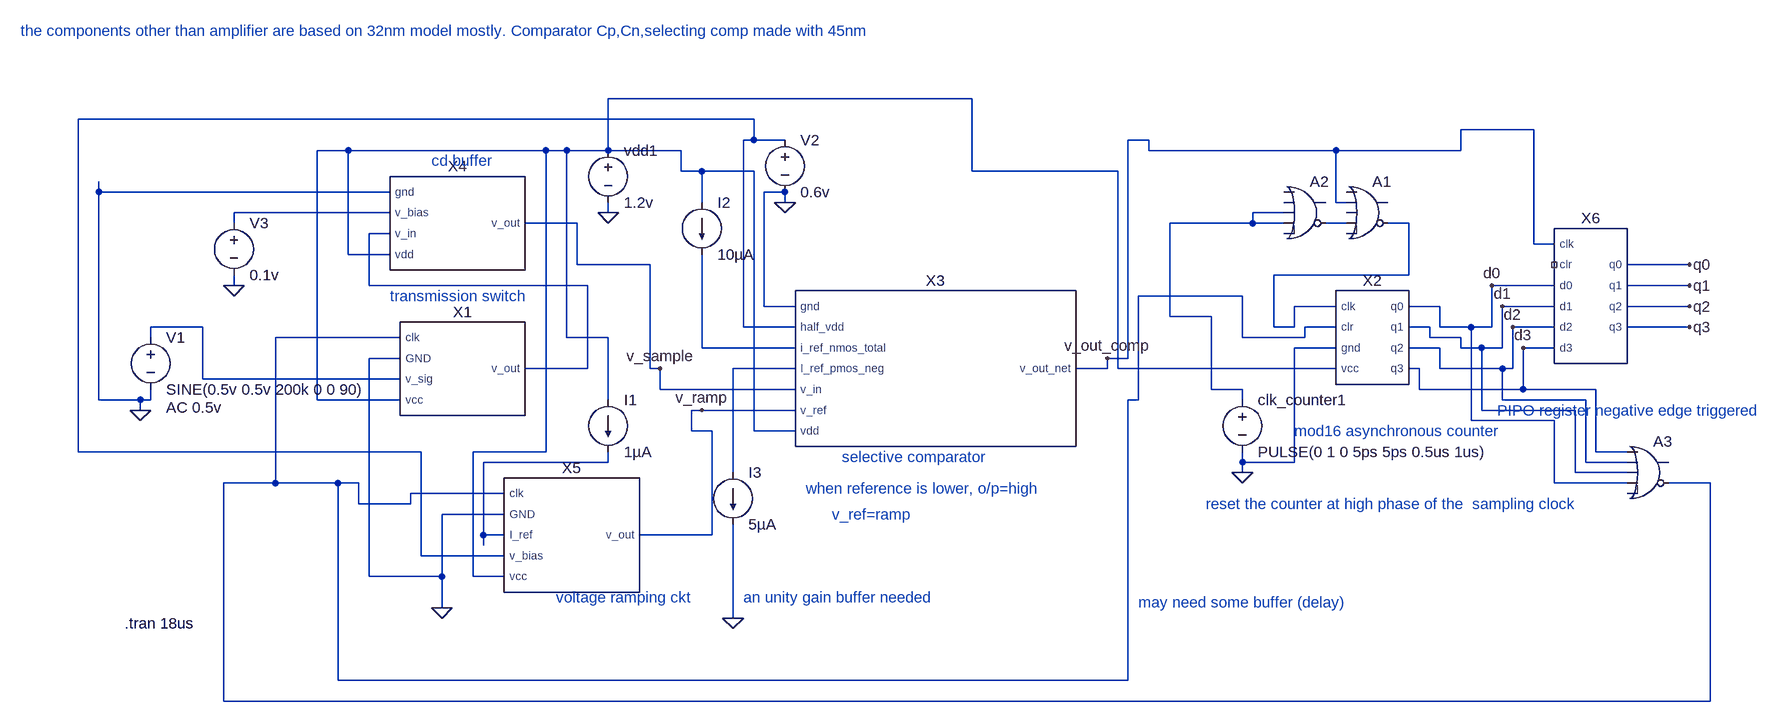
[diagram p0: schematic ADC_allblocks_oneClock.asc]
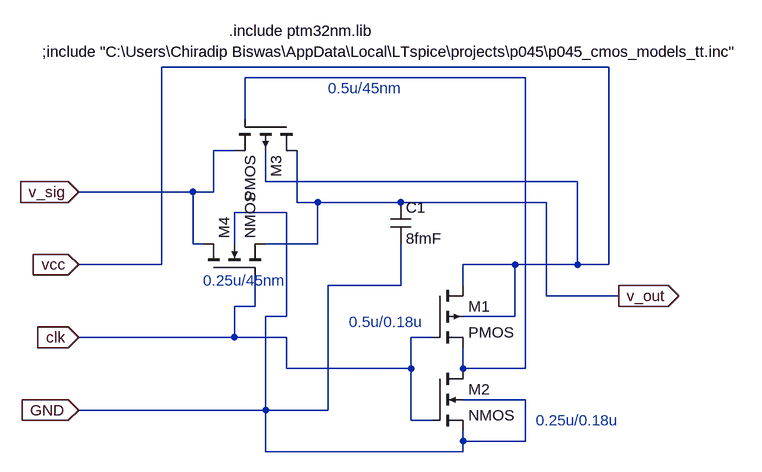
[diagram p1: sub-circuit transmission_switch_100ns_5ns_5ps_8fmf_symbolckt.asc]
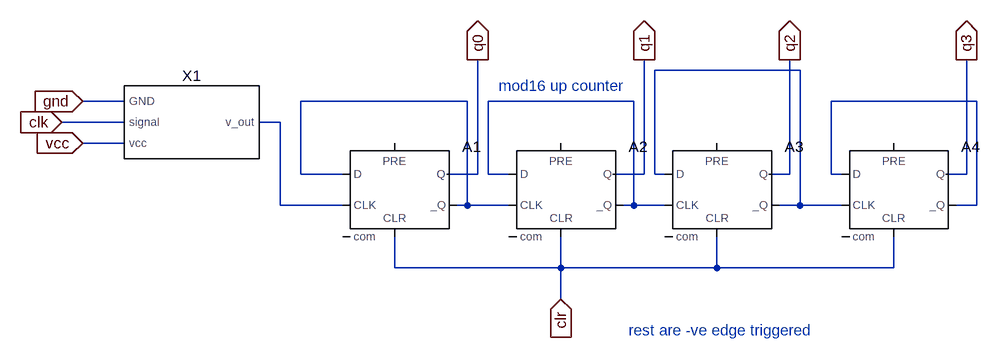
[diagram p2: sub-circuit mod16upcounter_ckt.asc]
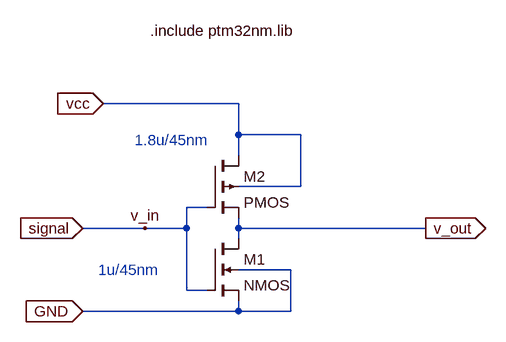
[diagram p3: sub-circuit fast_inverterckt.asc]
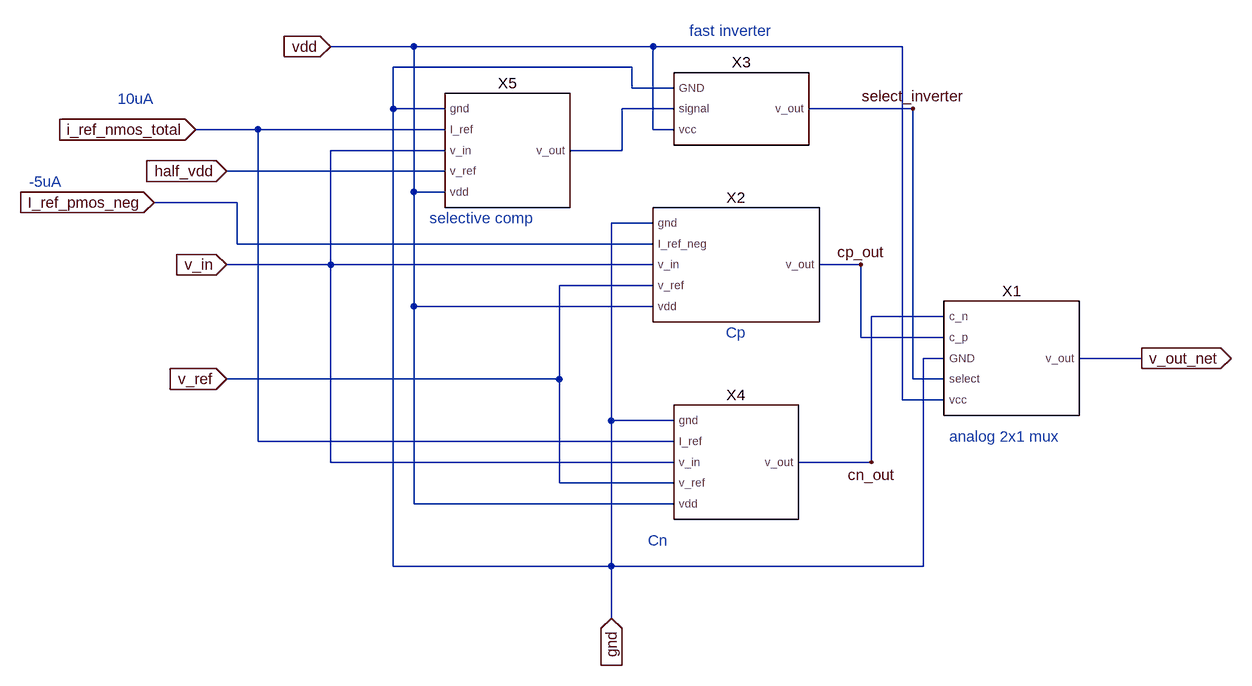
[diagram p4: sub-circuit cp_cn_selective_comp_new_ckt.asc]
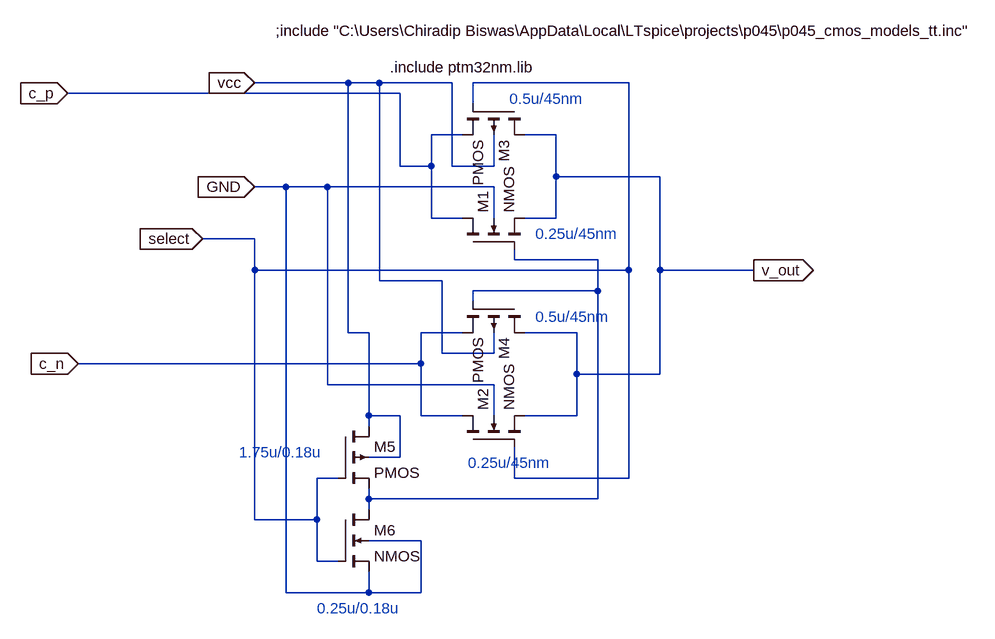
[diagram p5: sub-circuit analog_2_to_1mux.asc]
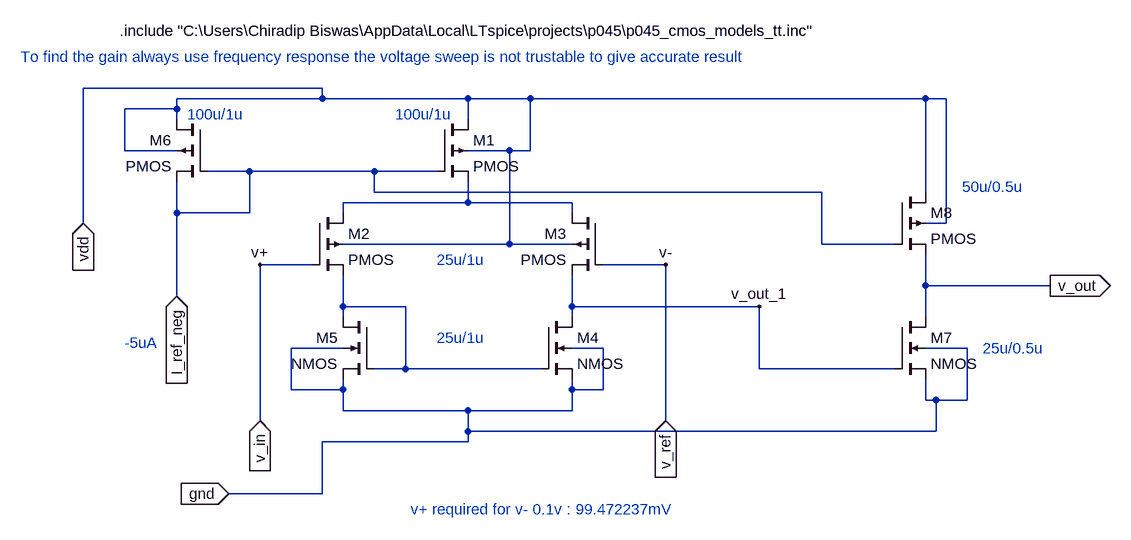
[diagram p6: sub-circuit static_comparator_pmosbased_ckt.asc]
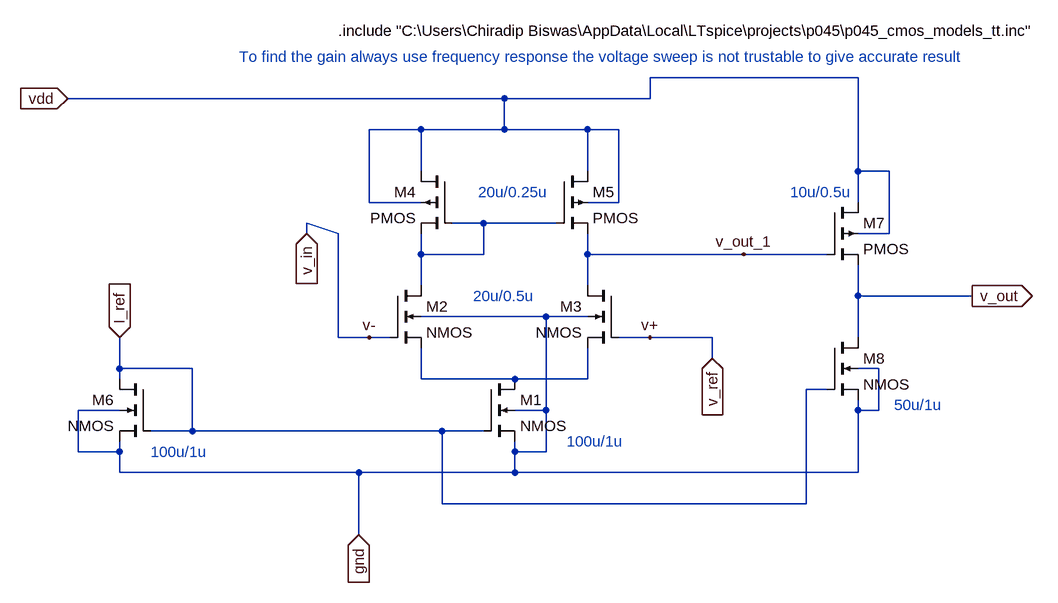
[diagram p7: sub-circuit static_comparator_nmos_based_ckt.asc]
ADC_allblocks_oneClock.asc, the LTspice schematic file:
Version 4
SHEET 1 2212 836
WIRE 960 -96 400 -96
WIRE 624 -64 -416 -64
WIRE 1824 -48 1712 -48
WIRE 624 -32 624 -64
WIRE 624 -32 608 -32
WIRE 672 -32 624 -32
WIRE 1232 -32 1200 -32
WIRE 0 -16 -48 -16
WIRE 304 -16 0 -16
WIRE 336 -16 304 -16
WIRE 400 -16 400 -96
WIRE 400 -16 336 -16
WIRE 512 -16 400 -16
WIRE 1232 -16 1232 -32
WIRE 1520 -16 1232 -16
WIRE 1712 -16 1712 -48
WIRE 1712 -16 1520 -16
WIRE 512 16 512 -16
WIRE 544 16 512 16
WIRE 624 16 544 16
WIRE 960 16 960 -96
WIRE 1184 16 960 16
WIRE -384 48 -384 32
WIRE 64 48 -384 48
WIRE 672 48 640 48
WIRE 544 64 544 16
WIRE 672 64 672 48
WIRE 1520 64 1520 -16
WIRE 1536 64 1520 64
WIRE 64 80 -176 80
WIRE 400 80 400 64
WIRE 1440 80 1392 80
WIRE -176 96 -176 80
WIRE 352 96 272 96
WIRE 1392 96 1392 80
WIRE 1392 96 1264 96
WIRE 1440 96 1392 96
WIRE 1536 96 1504 96
WIRE 1632 96 1600 96
WIRE 64 112 32 112
WIRE 1824 128 1824 -48
WIRE 1856 128 1824 128
WIRE 0 144 0 -16
WIRE 64 144 0 144
WIRE 352 160 352 96
WIRE 464 160 352 160
WIRE 2064 160 1968 160
WIRE 1632 176 1632 96
WIRE 1632 176 1424 176
WIRE -176 192 -176 176
WIRE 32 192 32 112
WIRE 368 192 32 192
WIRE 1856 192 1760 192
WIRE 2064 192 1968 192
WIRE 1376 208 1216 208
WIRE 640 224 640 48
WIRE 688 224 640 224
WIRE 1520 224 1456 224
WIRE 1680 224 1632 224
WIRE 1856 224 1776 224
WIRE 2064 224 1968 224
WIRE 1264 240 1264 96
WIRE 1328 240 1264 240
WIRE -224 256 -304 256
WIRE 608 256 608 -32
WIRE 688 256 608 256
WIRE 1424 256 1424 176
WIRE 1456 256 1456 224
WIRE 1456 256 1424 256
WIRE 1520 256 1472 256
WIRE 1664 256 1632 256
WIRE 1680 256 1680 224
WIRE 1728 256 1680 256
WIRE 1760 256 1760 192
WIRE 1760 256 1728 256
WIRE 1856 256 1792 256
WIRE 2064 256 1968 256
WIRE -304 272 -304 256
WIRE 80 272 -112 272
WIRE 336 272 336 -16
WIRE 400 272 336 272
WIRE 1376 272 1376 208
WIRE 1472 272 1472 256
WIRE 1472 272 1376 272
WIRE 1664 272 1664 256
WIRE 1712 272 1664 272
WIRE 544 288 544 144
WIRE 688 288 544 288
WIRE 1520 288 1456 288
WIRE 1680 288 1632 288
WIRE 1712 288 1712 272
WIRE 1744 288 1712 288
WIRE 1776 288 1776 224
WIRE 1776 288 1744 288
WIRE 1856 288 1808 288
WIRE 80 304 32 304
WIRE 1200 304 1200 -32
WIRE 1200 304 1168 304
WIRE 368 320 368 192
WIRE 368 320 272 320
WIRE 464 320 464 160
WIRE 480 320 464 320
WIRE 688 320 592 320
WIRE 1168 320 1168 304
WIRE 1168 320 1120 320
WIRE 1184 320 1184 16
WIRE 1520 320 1184 320
WIRE 1648 320 1632 320
WIRE 1680 320 1680 288
WIRE 1776 320 1680 320
WIRE 1792 320 1792 256
WIRE 1792 320 1776 320
WIRE -224 336 -224 256
WIRE 80 336 -224 336
WIRE 480 352 480 320
WIRE 688 352 480 352
WIRE 1328 352 1328 240
WIRE 1376 352 1328 352
WIRE 1648 352 1648 320
WIRE 1808 352 1808 288
WIRE 1808 352 1648 352
WIRE 1920 352 1808 352
WIRE -384 368 -384 48
WIRE -320 368 -384 368
WIRE -304 368 -304 352
WIRE -304 368 -320 368
WIRE -48 368 -48 -16
WIRE 80 368 -48 368
WIRE 400 368 400 272
WIRE 1216 368 1216 208
WIRE 1216 368 1200 368
WIRE 1376 368 1376 352
WIRE 1776 368 1776 320
WIRE 1904 368 1776 368
WIRE -320 384 -320 368
WIRE 544 384 528 384
WIRE 688 384 544 384
WIRE 1744 384 1744 288
WIRE 1888 384 1744 384
WIRE 1728 400 1728 256
WIRE 1856 400 1728 400
WIRE 528 416 528 384
WIRE 560 416 528 416
WIRE 624 416 624 16
WIRE 688 416 624 416
WIRE -416 448 -416 -64
WIRE 112 448 -416 448
WIRE 304 448 304 -16
WIRE 304 448 192 448
WIRE 1920 448 1920 352
WIRE 1968 448 1920 448
WIRE 400 464 400 448
WIRE 400 464 208 464
WIRE 1376 464 1376 448
WIRE 1456 464 1456 288
WIRE 1456 464 1376 464
WIRE 1904 464 1904 368
WIRE 1968 464 1904 464
WIRE 592 480 592 320
WIRE 1376 480 1376 464
WIRE 1888 480 1888 384
WIRE 1968 480 1888 480
WIRE -112 496 -112 272
WIRE -112 496 -192 496
WIRE -16 496 -112 496
WIRE 16 496 -16 496
WIRE 1856 496 1856 400
WIRE 1968 496 1856 496
WIRE 2096 496 2032 496
WIRE 240 512 96 512
WIRE 16 528 16 496
WIRE 96 528 96 512
WIRE 96 528 16 528
WIRE 240 544 144 544
WIRE 208 576 208 464
WIRE 240 576 208 576
WIRE 560 576 560 416
WIRE 560 576 448 576
WIRE 208 592 208 576
WIRE 112 608 112 448
WIRE 240 608 112 608
WIRE 32 640 32 304
WIRE 144 640 144 544
WIRE 144 640 32 640
WIRE 192 640 192 448
WIRE 240 640 192 640
WIRE 144 688 144 640
WIRE 592 704 592 560
WIRE -16 800 -16 496
WIRE 1200 800 1200 368
WIRE 1200 800 -16 800
WIRE -192 832 -192 496
WIRE 2096 832 2096 496
WIRE 2096 832 -192 832
FLAG -320 384 0
FLAG 400 80 0
FLAG 144 688 0
FLAG 1168 304 v_out_comp
FLAG 672 64 0
FLAG 1376 480 0
FLAG 1760 192 d0
FLAG 1776 224 d1
FLAG 1792 256 d2
FLAG 1808 288 d3
FLAG 2064 192 q1
FLAG 2064 224 q2
FLAG 2064 256 q3
FLAG 544 384 v_ramp
FLAG 480 320 v_sample
FLAG 592 704 0
FLAG -176 192 0
FLAG 2064 160 q0
SYMBOL transmission_switch_100ns_5ns_5ps_8fmF_symbolCKT 176 320 R0
SYMATTR InstName X1
SYMBOL voltage -304 256 R0
WINDOW 123 24 124 Left 2
WINDOW 39 0 0 Left 0
SYMATTR Value2 AC 0.5v
SYMATTR InstName V1
SYMATTR Value SINE(0.5v 0.5v 200k 0 0 90)
SYMBOL voltage 400 -32 R0
WINDOW 123 0 0 Left 0
WINDOW 39 0 0 Left 0
SYMATTR InstName vdd1
SYMATTR Value 1.2v
SYMBOL current 400 368 R0
WINDOW 123 0 0 Left 0
WINDOW 39 0 0 Left 0
SYMATTR InstName I1
SYMATTR Value 1µA
SYMBOL voltage 672 -48 R0
WINDOW 123 0 0 Left 0
WINDOW 39 0 0 Left 0
SYMATTR InstName V2
SYMATTR Value 0.6v
SYMBOL voltage 1376 352 R0
WINDOW 123 0 0 Left 0
WINDOW 39 0 0 Left 0
SYMATTR InstName clk_counter1
SYMATTR Value PULSE(0 1 0 5ps 5ps 0.5us 1us)
SYMBOL mod16UpCounter_ckt 1568 272 R0
SYMATTR InstName X2
SYMBOL cp_cn_selective_comp_new_ckt 896 320 R0
SYMATTR InstName X3
SYMBOL current 544 64 R0
WINDOW 123 0 0 Left 0
WINDOW 39 0 0 Left 0
SYMATTR InstName I2
SYMATTR Value 10µA
SYMBOL current 592 480 R0
WINDOW 123 0 0 Left 0
WINDOW 39 0 0 Left 0
SYMATTR InstName I3
SYMATTR Value 5µA
SYMBOL Digital\\or 1568 16 R0
SYMATTR InstName A1
SYMBOL Digital\\or 1472 16 R0
SYMATTR InstName A2
SYMBOL cd_buffer_const_pot 160 96 R0
SYMATTR InstName X4
SYMBOL voltage -176 80 R0
WINDOW 123 0 0 Left 0
WINDOW 39 0 0 Left 0
SYMATTR InstName V3
SYMATTR Value 0.1v
SYMBOL ramp_ckt_32nm_cd_buffer_ckt 336 576 R0
SYMATTR InstName X5
SYMBOL 1st_stage_pos_edge_4bit_pipo 1904 208 R0
SYMATTR InstName X6
SYMBOL Digital\\or 2000 416 R0
SYMATTR InstName A3
TEXT -344 712 Left 2 !.tran 18us
TEXT 64 208 Left 2 ;transmission switch
TEXT 320 672 Left 2 ;voltage ramping ckt
TEXT 760 456 Left 2 ;selective comparator
TEXT 704 504 Left 2 ;when reference is lower, o/p=high
TEXT 1768 384 Left 2 ;PIPO register negative edge triggered
TEXT 1456 416 Left 2 ;mod16 asynchronous counter
TEXT 1320 528 Left 2 ;reset the counter at high phase of the  sampling clock
TEXT 1216 680 Left 2 ;may need some buffer (delay)
TEXT 608 672 Left 2 ;an unity gain buffer needed
TEXT 744 544 Left 2 ;v_ref=ramp
TEXT -504 -200 Left 2 ;the components other than amplifier are based on 32nm model mostly. Comparator Cp,Cn,selecting comp made with 45nm
TEXT 128 0 Left 2 ;cd buffer

transmission_switch_100ns_5ns_5ps_8fmf_symbolckt.asc, the sub-circuit schematic file:
Version 4
SHEET 1 1200 680
WIRE 864 -144 176 -144
WIRE 736 -128 304 -128
WIRE 304 -64 304 -128
WIRE 288 -16 256 -16
WIRE 336 32 336 -16
WIRE 816 32 336 32
WIRE 224 48 48 48
WIRE 256 48 256 -16
WIRE 256 48 224 48
WIRE 384 64 384 -16
WIRE 416 64 384 64
WIRE 544 64 416 64
WIRE 768 64 544 64
WIRE 368 80 288 80
WIRE 224 128 224 48
WIRE 240 128 224 128
WIRE 288 128 288 80
WIRE 416 128 416 64
WIRE 416 128 336 128
WIRE 176 160 176 -144
WIRE 176 160 48 160
WIRE 720 160 640 160
WIRE 816 160 816 32
WIRE 816 160 720 160
WIRE 864 160 864 -144
WIRE 864 160 816 160
WIRE 544 192 544 128
WIRE 544 192 432 192
WIRE 640 192 640 160
WIRE 768 208 768 64
WIRE 880 208 768 208
WIRE 320 224 320 176
WIRE 320 224 288 224
WIRE 368 240 368 80
WIRE 368 240 336 240
WIRE 720 240 720 160
WIRE 720 240 640 240
WIRE 288 272 288 224
WIRE 288 272 48 272
WIRE 368 272 288 272
WIRE 592 272 560 272
WIRE 368 320 368 272
WIRE 560 320 560 272
WIRE 560 320 368 320
WIRE 640 320 640 288
WIRE 736 320 736 -128
WIRE 736 320 640 320
WIRE 736 368 640 368
WIRE 336 384 336 240
WIRE 336 384 48 384
WIRE 432 384 432 192
WIRE 432 384 336 384
WIRE 560 400 560 320
WIRE 592 400 560 400
WIRE 640 432 640 416
WIRE 736 432 736 368
WIRE 736 432 640 432
WIRE 336 448 336 384
WIRE 640 448 640 432
WIRE 640 448 336 448
FLAG 48 48 v_sig
IOPIN 48 48 In
FLAG 48 272 clk
IOPIN 48 272 In
FLAG 48 160 vcc
IOPIN 48 160 In
FLAG 880 208 v_out
IOPIN 880 208 Out
FLAG 48 384 GND
IOPIN 48 384 In
SYMBOL pmos4 592 192 R0
SYMATTR InstName M1
SYMATTR Value2 l=45nm w=30u
SYMBOL nmos4 592 320 R0
SYMATTR InstName M2
SYMATTR Value2 l=45nm w=15u
SYMBOL pmos4 384 -64 R90
SYMATTR InstName M3
SYMATTR Value2 l=45nm w=0.5u
SYMBOL nmos4 240 176 R270
SYMATTR InstName M4
SYMATTR Value2 l=45nm w=0.25u
SYMBOL cap 528 64 R0
SYMATTR InstName C1
SYMATTR Value 8fmF
TEXT 280 -200 Left 2 !.include ptm32nm.lib
TEXT 240 184 Left 2 ;0.25u/45nm
TEXT 752 400 Left 2 ;0.25u/0.18u
TEXT 464 248 Left 2 ;0.5u/0.18u
TEXT 432 -112 Left 2 ;0.5u/45nm
TEXT -8 -168 Left 2 !;include "C:\\Users\\Chiradip Biswas\\AppData\\Local\\LTspice\\projects\\p045\\p045_cmos_models_tt.inc"

mod16upcounter_ckt.asc, the sub-circuit schematic file:
Version 4
SHEET 1 1048 680
WIRE 720 -48 496 -48
WIRE -320 0 -384 0
WIRE 208 0 -48 0
WIRE 464 0 240 0
WIRE 992 0 768 0
WIRE -320 32 -416 32
WIRE -80 32 -112 32
WIRE -320 64 -384 64
WIRE -48 112 -48 0
WIRE 16 112 -48 112
WIRE 224 112 224 -64
WIRE 224 112 176 112
WIRE 240 112 240 0
WIRE 272 112 240 112
WIRE 480 112 480 -64
WIRE 480 112 432 112
WIRE 496 112 496 -48
WIRE 512 112 496 112
WIRE 704 112 704 -64
WIRE 704 112 672 112
WIRE 768 112 768 0
WIRE 784 112 768 112
WIRE 976 112 976 -64
WIRE 976 112 944 112
WIRE -80 160 -80 32
WIRE 16 160 -80 160
WIRE 208 160 208 0
WIRE 208 160 192 160
WIRE 272 160 208 160
WIRE 464 160 464 0
WIRE 464 160 448 160
WIRE 512 160 464 160
WIRE 720 160 720 -48
WIRE 720 160 688 160
WIRE 784 160 720 160
WIRE 992 160 992 0
WIRE 992 160 960 160
WIRE 96 256 96 208
WIRE 352 256 352 208
WIRE 352 256 96 256
WIRE 592 256 592 208
WIRE 592 256 352 256
WIRE 864 256 864 208
WIRE 864 256 592 256
WIRE 352 304 352 256
FLAG 224 -64 q0
IOPIN 224 -64 Out
FLAG 480 -64 q1
IOPIN 480 -64 Out
FLAG 704 -64 q2
IOPIN 704 -64 Out
FLAG 352 304 clr
IOPIN 352 304 In
FLAG -416 32 clk
IOPIN -416 32 In
FLAG 976 -64 q3
IOPIN 976 -64 Out
FLAG -384 64 vcc
IOPIN -384 64 In
FLAG -384 0 gnd
IOPIN -384 0 In
SYMBOL Digital\\dflop 96 64 R0
SYMATTR InstName A1
SYMBOL Digital\\dflop 352 64 R0
SYMATTR InstName A2
SYMBOL Digital\\dflop 592 64 R0
SYMATTR InstName A3
SYMBOL Digital\\dflop 864 64 R0
SYMATTR InstName A4
SYMBOL fast_inverterCKT -224 32 R0
SYMATTR InstName X1
TEXT 456 352 Left 2 ;rest are -ve edge triggered
TEXT 256 -24 Left 2 ;mod16 up counter

fast_inverterckt.asc, the sub-circuit schematic file:
Version 4
SHEET 1 1464 680
WIRE 352 32 144 32
WIRE 352 80 352 32
WIRE 448 80 352 80
WIRE 352 112 352 80
WIRE 448 160 448 80
WIRE 448 160 352 160
WIRE 304 192 272 192
WIRE 208 224 112 224
WIRE 272 224 272 192
WIRE 272 224 208 224
WIRE 352 224 352 208
WIRE 640 224 352 224
WIRE 352 240 352 224
WIRE 432 288 352 288
WIRE 272 320 272 224
WIRE 304 320 272 320
WIRE 352 352 352 336
WIRE 352 352 112 352
WIRE 432 352 432 288
WIRE 432 352 352 352
FLAG 208 224 v_in
FLAG 144 32 vcc
IOPIN 144 32 In
FLAG 112 224 signal
IOPIN 112 224 In
FLAG 112 352 GND
IOPIN 112 352 In
FLAG 640 224 v_out
IOPIN 640 224 Out
SYMBOL nmos4 304 240 R0
SYMATTR InstName M1
SYMATTR Value2 l=45nm w=1u
SYMBOL pmos4 304 112 R0
SYMATTR InstName M2
SYMATTR Value2 l=45nm w=1.8u
TEXT 192 88 Left 2 ;1.8u/45nm
TEXT 136 288 Left 2 ;1u/45nm
TEXT 216 -80 Left 2 !.include ptm32nm.lib

cp_cn_selective_comp_new_ckt.asc, the sub-circuit schematic file:
Version 4
SHEET 1 2192 824
WIRE 896 -160 768 -160
WIRE 1264 -160 896 -160
WIRE 1648 -160 1264 -160
WIRE 1232 -128 864 -128
WIRE 1232 -96 1232 -128
WIRE 1296 -96 1232 -96
WIRE 864 -64 864 -128
WIRE 944 -64 864 -64
WIRE 1296 -64 1216 -64
WIRE 1664 -64 1504 -64
WIRE 656 -32 560 -32
WIRE 944 -32 656 -32
WIRE 1264 -32 1264 -160
WIRE 1296 -32 1264 -32
WIRE 944 0 768 0
WIRE 1216 0 1216 -64
WIRE 1216 0 1136 0
WIRE 944 32 608 32
WIRE 896 64 896 -160
WIRE 944 64 896 64
WIRE 624 80 496 80
WIRE 1264 112 1200 112
WIRE 624 144 624 80
WIRE 1264 144 624 144
WIRE 768 176 768 0
WIRE 768 176 608 176
WIRE 1264 176 768 176
WIRE 1584 176 1520 176
WIRE 1264 208 1120 208
WIRE 896 240 896 64
WIRE 1264 240 896 240
WIRE 1712 256 1600 256
WIRE 1584 288 1584 176
WIRE 1712 288 1584 288
WIRE 1712 320 1680 320
WIRE 2016 320 1920 320
WIRE 1120 352 1120 208
WIRE 1120 352 608 352
WIRE 1664 352 1664 -64
WIRE 1712 352 1664 352
WIRE 1648 384 1648 -160
WIRE 1712 384 1648 384
WIRE 1200 416 1200 112
WIRE 1296 416 1200 416
WIRE 656 448 656 -32
WIRE 1296 448 656 448
WIRE 768 480 768 176
WIRE 1296 480 768 480
WIRE 1600 480 1600 256
WIRE 1600 480 1488 480
WIRE 1120 512 1120 352
WIRE 1296 512 1120 512
WIRE 896 544 896 240
WIRE 1296 544 896 544
WIRE 864 640 864 -64
WIRE 1200 640 1200 416
WIRE 1200 640 864 640
WIRE 1680 640 1680 320
WIRE 1680 640 1200 640
WIRE 1200 720 1200 640
FLAG 768 -160 vdd
IOPIN 768 -160 In
FLAG 2016 320 v_out_net
IOPIN 2016 320 Out
FLAG 1200 720 gnd
IOPIN 1200 720 In
FLAG 560 -32 i_ref_nmos_total
IOPIN 560 -32 In
FLAG 608 32 half_vdd
IOPIN 608 32 In
FLAG 608 176 v_in
IOPIN 608 176 In
FLAG 608 352 v_ref
IOPIN 608 352 In
FLAG 496 80 I_ref_pmos_neg
IOPIN 496 80 In
FLAG 1584 176 cp_out
FLAG 1600 480 cn_out
FLAG 1664 -64 select_inverter
SYMBOL analog_2_to_1mux 1808 320 R0
SYMATTR InstName X1
SYMBOL static_comparator_pmosbased_ckt 1392 176 R0
SYMATTR InstName X2
SYMBOL fast_inverterCKT 1392 -64 R0
SYMATTR InstName X3
SYMBOL static_comparator_nmos_based_ckt 1392 480 R0
SYMATTR InstName X4
SYMBOL static_comparator_nmos_based_ckt 1040 0 R0
SYMATTR InstName X5
TEXT 1376 280 Left 2 ;Cp
TEXT 920 104 Left 2 ;selective comp
TEXT 1720 440 Left 2 ;analog 2x1 mux
TEXT 1256 600 Left 2 ;Cn
TEXT 1320 -184 Left 2 ;fast inverter
TEXT 440 -80 Left 2 ;10uA
TEXT 304 48 Left 2 ;-5uA

analog_2_to_1mux.asc, the sub-circuit schematic file:
Version 4
SHEET 1 1128 872
WIRE 32 48 -112 48
WIRE 80 48 32 48
WIRE 192 48 80 48
WIRE 464 48 224 48
WIRE 112 64 -400 64
WIRE 224 80 224 48
WIRE 208 128 160 128
WIRE 352 128 304 128
WIRE 112 176 112 64
WIRE 160 176 160 128
WIRE 160 176 112 176
WIRE 192 176 192 48
WIRE 256 176 256 128
WIRE 256 176 192 176
WIRE 352 192 352 128
WIRE 512 192 352 192
WIRE -64 208 -112 208
WIRE 0 208 -64 208
WIRE 256 208 0 208
WIRE 160 256 160 176
WIRE 208 256 160 256
WIRE 256 256 256 208
WIRE 352 256 352 192
WIRE 352 256 304 256
WIRE -112 288 -192 288
WIRE 288 320 288 304
WIRE 416 320 288 320
WIRE -112 336 -112 288
WIRE 464 336 464 48
WIRE 464 336 -112 336
WIRE 512 336 512 192
WIRE 656 336 512 336
WIRE 80 352 80 48
WIRE 176 352 80 352
WIRE 416 368 416 320
WIRE 416 368 224 368
WIRE 224 384 224 368
WIRE 32 432 32 48
WIRE 64 432 32 432
WIRE 208 432 144 432
WIRE 384 432 304 432
WIRE 176 464 176 352
WIRE 256 464 256 432
WIRE 256 464 176 464
WIRE 144 480 144 432
WIRE 144 480 -384 480
WIRE 384 496 384 432
WIRE 512 496 512 336
WIRE 512 496 384 496
WIRE 0 512 0 208
WIRE 256 512 0 512
WIRE 64 560 64 432
WIRE 112 560 64 560
WIRE 144 560 144 480
WIRE 208 560 144 560
WIRE 256 560 256 512
WIRE 384 560 384 496
WIRE 384 560 304 560
WIRE 64 576 64 560
WIRE 112 624 112 560
WIRE 112 624 64 624
WIRE 16 656 -16 656
WIRE 288 656 288 608
WIRE 464 656 464 336
WIRE 464 656 288 656
WIRE 64 688 64 672
WIRE 416 688 416 368
WIRE 416 688 64 688
WIRE 64 704 64 688
WIRE -112 720 -112 336
WIRE -16 720 -16 656
WIRE -16 720 -112 720
WIRE 144 752 64 752
WIRE -16 784 -16 720
WIRE 16 784 -16 784
WIRE -64 832 -64 208
WIRE 64 832 64 800
WIRE 64 832 -64 832
WIRE 144 832 144 752
WIRE 144 832 64 832
FLAG 656 336 v_out
IOPIN 656 336 Out
FLAG -192 288 select
IOPIN -192 288 In
FLAG -400 64 c_p
IOPIN -400 64 In
FLAG -384 480 c_n
IOPIN -384 480 In
FLAG -112 208 GND
IOPIN -112 208 In
FLAG -112 48 vcc
IOPIN -112 48 In
SYMBOL nmos4 208 304 R270
SYMATTR InstName M1
SYMATTR Value2 l=45nm w=0.25u
SYMBOL nmos4 208 608 R270
SYMATTR InstName M2
SYMATTR Value2 l=45nm w=0.25u
SYMBOL pmos4 304 80 R90
SYMATTR InstName M3
SYMATTR Value2 l=45nm w=0.5u
SYMBOL pmos4 304 384 R90
SYMATTR InstName M4
SYMATTR Value2 l=45nm w=0.5u
SYMBOL pmos4 16 576 R0
SYMATTR InstName M5
SYMATTR Value2 l=0.18u w=1.75u
SYMBOL nmos4 16 704 R0
SYMATTR InstName M6
SYMATTR Value2 l=0.18u w=0.25u
TEXT 96 24 Left 2 !.include ptm32nm.lib
TEXT 280 72 Left 2 ;0.5u/45nm
TEXT 320 408 Left 2 ;0.5u/45nm
TEXT 320 280 Left 2 ;0.25u/45nm
TEXT 216 632 Left 2 ;0.25u/45nm
TEXT -136 616 Left 2 ;1.75u/0.18u
TEXT -16 856 Left 2 ;0.25u/0.18u
TEXT -80 -32 Left 2 !;include "C:\\Users\\Chiradip Biswas\\AppData\\Local\\LTspice\\projects\\p045\\p045_cmos_models_tt.inc"

static_comparator_pmosbased_ckt.asc, the sub-circuit schematic file:
Version 4
SHEET 1 1308 712
WIRE 64 0 -304 0
WIRE 64 16 64 0
WIRE 64 16 -160 16
WIRE 288 16 64 16
WIRE 384 16 288 16
WIRE 992 16 384 16
WIRE 1024 16 992 16
WIRE -160 32 -160 16
WIRE -160 32 -240 32
WIRE -160 48 -160 32
WIRE 288 48 288 16
WIRE -240 96 -240 32
WIRE -160 96 -240 96
WIRE 352 96 288 96
WIRE 384 96 384 16
WIRE 384 96 352 96
WIRE -48 128 -112 128
WIRE 144 128 -48 128
WIRE 240 128 144 128
WIRE 144 160 144 128
WIRE 832 160 144 160
WIRE 992 160 992 16
WIRE 288 176 288 144
WIRE 288 176 96 176
WIRE 448 176 288 176
WIRE -160 192 -160 144
WIRE -48 192 -48 128
WIRE -48 192 -160 192
WIRE 96 192 96 176
WIRE 448 192 448 176
WIRE -304 208 -304 0
WIRE 1024 208 1024 16
WIRE 1024 208 992 208
WIRE 352 240 352 96
WIRE 352 240 96 240
WIRE 448 240 352 240
WIRE 832 240 832 160
WIRE 944 240 832 240
WIRE 48 272 -32 272
WIRE 592 272 496 272
WIRE 992 304 992 256
WIRE 1184 304 992 304
WIRE -160 320 -160 192
WIRE 96 336 96 288
WIRE 192 336 96 336
WIRE 448 336 448 288
WIRE 736 336 448 336
WIRE 96 352 96 336
WIRE 448 352 448 336
WIRE 992 352 992 304
WIRE 96 400 16 400
WIRE 496 400 448 400
WIRE 1056 400 992 400
WIRE 192 432 192 336
WIRE 192 432 144 432
WIRE 400 432 192 432
WIRE 736 432 736 336
WIRE 944 432 736 432
WIRE 16 464 16 400
WIRE 96 464 96 448
WIRE 96 464 16 464
WIRE 448 464 448 448
WIRE 496 464 496 400
WIRE 496 464 448 464
WIRE 992 480 992 448
WIRE 1008 480 992 480
WIRE 1056 480 1056 400
WIRE 1056 480 1008 480
WIRE 96 496 96 464
WIRE 288 496 96 496
WIRE 448 496 448 464
WIRE 448 496 288 496
WIRE -32 512 -32 272
WIRE 592 512 592 272
WIRE 288 528 288 496
WIRE 1008 528 1008 480
WIRE 1008 528 288 528
WIRE 288 544 288 528
WIRE 288 544 64 544
WIRE 64 624 64 544
WIRE 64 624 -80 624
FLAG 736 336 v_out_1
FLAG 592 272 v-
FLAG -32 272 v+
FLAG 1184 304 v_out
IOPIN 1184 304 Out
FLAG 592 512 v_ref
IOPIN 592 512 In
FLAG -32 512 v_in
IOPIN -32 512 In
FLAG -160 320 I_ref_neg
IOPIN -160 320 In
FLAG -304 208 vdd
IOPIN -304 208 In
FLAG -80 624 gnd
IOPIN -80 624 In
SYMBOL pmos4 240 48 R0
SYMATTR InstName M1
SYMATTR Value2 l=1u w=100u
SYMBOL pmos4 48 192 R0
SYMATTR InstName M2
SYMATTR Value2 l=1u w=25u
SYMBOL pmos4 496 192 M0
SYMATTR InstName M3
SYMATTR Value2 l=1u w=25u
SYMBOL nmos4 400 352 R0
SYMATTR InstName M4
SYMATTR Value2 l=1u w=25u
SYMBOL nmos4 144 352 M0
SYMATTR InstName M5
SYMATTR Value2 l=1u w=25u
SYMBOL pmos4 -112 48 M0
SYMATTR InstName M6
SYMATTR Value2 l=1u w=100u
SYMBOL nmos4 944 352 R0
SYMATTR InstName M7
SYMATTR Value2 l=0.5u w=25u
SYMBOL pmos4 944 160 R0
SYMATTR InstName M8
SYMATTR Value2 l=0.5u w=50u
TEXT -248 -88 Left 2 !.include "C:\\Users\\Chiradip Biswas\\AppData\\Local\\LTspice\\projects\\p045\\p045_cmos_models_tt.inc"
TEXT -400 -48 Left 2 ;To find the gain always use frequency response the voltage sweep is not trustable to give accurate result
TEXT 240 264 Left 2 ;25u/1u
TEXT 176 40 Left 2 ;100u/1u
TEXT -144 40 Left 2 ;100u/1u
TEXT 240 384 Left 2 ;25u/1u
TEXT 1048 152 Left 2 ;50u/0.5u
TEXT 1080 400 Left 2 ;25u/0.5u
TEXT 200 648 Left 2 ;v+ required for v- 0.1v : 99.472237mV
TEXT -240 392 Left 2 ;-5uA

static_comparator_nmos_based_ckt.asc, the sub-circuit schematic file:
Version 4
SHEET 1 1336 680
WIRE 928 -144 608 -144
WIRE 384 -112 -288 -112
WIRE 608 -112 608 -144
WIRE 608 -112 384 -112
WIRE 256 -64 176 -64
WIRE 384 -64 384 -112
WIRE 384 -64 256 -64
WIRE 512 -64 384 -64
WIRE 560 -64 512 -64
WIRE 256 0 256 -64
WIRE 512 0 512 -64
WIRE 928 0 928 -144
WIRE 976 0 928 0
WIRE 176 48 176 -64
WIRE 256 48 176 48
WIRE 560 48 560 -64
WIRE 560 48 512 48
WIRE 928 48 928 0
WIRE 352 80 304 80
WIRE 464 80 352 80
WIRE 80 96 80 80
WIRE 128 96 80 80
WIRE 976 96 976 0
WIRE 976 96 928 96
WIRE 256 128 256 96
WIRE 352 128 352 80
WIRE 352 128 256 128
WIRE 512 128 512 96
WIRE 752 128 512 128
WIRE 880 128 752 128
WIRE 256 176 256 128
WIRE 512 176 512 128
WIRE 928 192 928 144
WIRE 1104 192 928 192
WIRE 448 224 256 224
WIRE 512 224 448 224
WIRE 128 256 128 96
WIRE 176 256 128 256
WIRE 208 256 176 256
WIRE 608 256 560 256
WIRE 704 256 608 256
WIRE 928 256 928 192
WIRE 704 288 704 256
WIRE -208 304 -208 256
WIRE -96 304 -208 304
WIRE 960 304 928 304
WIRE -208 320 -208 304
WIRE 256 320 256 272
WIRE 400 320 256 320
WIRE 512 320 512 272
WIRE 512 320 400 320
WIRE 880 336 848 336
WIRE -208 368 -272 368
WIRE 448 368 448 224
WIRE 448 368 400 368
WIRE 928 368 928 352
WIRE 960 368 960 304
WIRE 960 368 928 368
WIRE -96 400 -96 304
WIRE -96 400 -160 400
WIRE 288 400 -96 400
WIRE 352 400 288 400
WIRE -272 432 -272 368
WIRE -208 432 -208 416
WIRE -208 432 -272 432
WIRE 400 432 400 416
WIRE 448 432 448 368
WIRE 448 432 400 432
WIRE -208 464 -208 432
WIRE 160 464 -208 464
WIRE 400 464 400 432
WIRE 400 464 160 464
WIRE 928 464 928 368
WIRE 928 464 400 464
WIRE 288 512 288 400
WIRE 848 512 848 336
WIRE 848 512 288 512
WIRE 160 560 160 464
FLAG 608 256 v+
FLAG 176 256 v-
FLAG 752 128 v_out_1
FLAG 1104 192 v_out
IOPIN 1104 192 Out
FLAG 704 288 v_ref
IOPIN 704 288 In
FLAG 80 96 v_in
IOPIN 80 96 In
FLAG -288 -112 vdd
IOPIN -288 -112 In
FLAG -208 256 I_ref
IOPIN -208 256 In
FLAG 160 560 gnd
IOPIN 160 560 In
SYMBOL nmos4 352 320 R0
SYMATTR InstName M1
SYMATTR Value2 l=1u w=100u
SYMBOL nmos4 208 176 R0
SYMATTR InstName M2
SYMATTR Value2 l=0.5u w=20u
SYMBOL nmos4 560 176 M0
SYMATTR InstName M3
SYMATTR Value2 l=0.5u w=20u
SYMBOL pmos4 304 0 M0
SYMATTR InstName M4
SYMATTR Value2 l=0.25u w=20u
SYMBOL pmos4 464 0 R0
SYMATTR InstName M5
SYMATTR Value2 l=0.25u w=20u
SYMBOL nmos4 -160 320 M0
SYMATTR InstName M6
SYMATTR Value2 l=1u w=100u
SYMBOL pmos4 880 48 R0
SYMATTR InstName M7
SYMATTR Value2 l=0.5u w=10u
SYMBOL nmos4 880 256 R0
SYMATTR InstName M8
SYMATTR Value2 l=0.5u w=50u
TEXT 128 -216 Left 2 !.include "C:\\Users\\Chiradip Biswas\\AppData\\Local\\LTspice\\projects\\p045\\p045_cmos_models_tt.inc"
TEXT 480 416 Left 2 ;100u/1u
TEXT 344 32 Left 2 ;20u/0.25u
TEXT 336 192 Left 2 ;20u/0.5u
TEXT -160 432 Left 2 ;100u/1u
TEXT 824 32 Left 2 ;10u/0.5u
TEXT 984 360 Left 2 ;50u/1u
TEXT -24 -176 Left 2 ;To find the gain always use frequency response the voltage sweep is not trustable to give accurate result

cd_buffer_const_pot.asc, the sub-circuit schematic file:
Version 4
SHEET 1 880 680
WIRE 224 -16 176 -16
WIRE 176 64 176 -16
WIRE 176 64 64 64
WIRE 224 112 224 -16
WIRE 320 160 224 160
WIRE 176 192 112 192
WIRE 224 256 224 208
WIRE 432 256 224 256
WIRE 224 320 224 256
WIRE 320 368 320 160
WIRE 320 368 224 368
WIRE 176 400 0 400
WIRE 224 432 224 416
WIRE 320 432 320 368
WIRE 320 432 224 432
WIRE 224 464 224 432
WIRE 224 464 0 464
FLAG 432 256 v_out
IOPIN 432 256 Out
FLAG 0 400 v_bias
IOPIN 0 400 In
FLAG 112 192 v_in
IOPIN 112 192 In
FLAG 64 64 vdd
IOPIN 64 64 In
FLAG 0 464 gnd
IOPIN 0 464 In
SYMBOL nmos4 176 112 R0
SYMATTR InstName M1
SYMATTR Value2 l=32nm w=80u
SYMBOL nmos4 176 320 R0
SYMATTR InstName M2
SYMATTR Value2 l=0.25u w=15u
TEXT 344 152 Left 2 ;80u/32nm
TEXT 344 392 Left 2 ;15u/0.25u
TEXT 88 -64 Left 2 !.include ptm32nm.lib
TEXT -72 360 Left 2 ;0.1v

ramp_ckt_32nm_cd_buffer_ckt.asc, the sub-circuit schematic file:
Version 4
SHEET 1 1036 680
WIRE 608 -96 -128 -96
WIRE 800 -96 608 -96
WIRE 496 0 -128 0
WIRE 496 80 496 0
WIRE 416 96 -128 96
WIRE 608 128 608 -96
WIRE 608 128 496 128
WIRE 800 144 800 -96
WIRE -128 160 -128 96
WIRE -128 160 -176 160
WIRE 112 160 -128 160
WIRE 416 160 416 96
WIRE 448 160 416 160
WIRE 256 176 176 176
WIRE 864 192 800 192
WIRE 48 224 -128 224
WIRE 496 224 496 176
WIRE 752 224 496 224
WIRE 176 240 176 176
WIRE 208 240 176 240
WIRE 256 240 256 176
WIRE 496 240 496 224
WIRE 496 240 304 240
WIRE 800 256 800 240
WIRE 912 256 800 256
WIRE 112 320 112 160
WIRE 288 320 288 288
WIRE 288 320 112 320
WIRE 800 320 800 256
WIRE 176 336 176 240
WIRE 496 336 496 304
WIRE 496 336 176 336
WIRE 592 336 496 336
WIRE 48 368 48 224
WIRE 176 368 176 336
WIRE 176 368 48 368
WIRE 864 368 864 192
WIRE 864 368 800 368
WIRE 736 384 -176 384
WIRE -176 400 -176 384
WIRE 736 400 736 384
WIRE 752 400 736 400
WIRE 592 432 592 336
WIRE 800 432 800 416
WIRE 800 432 592 432
WIRE 864 432 864 368
WIRE 864 432 800 432
FLAG -128 0 I_ref
IOPIN -128 0 In
FLAG -176 160 clk
IOPIN -176 160 In
FLAG -128 -96 vcc
IOPIN -128 -96 In
FLAG -128 224 GND
IOPIN -128 224 In
FLAG -176 400 v_bias
IOPIN -176 400 In
FLAG 912 256 v_out
IOPIN 912 256 Out
SYMBOL pmos4 448 80 R0
SYMATTR InstName M1
SYMATTR Value2 l=0.5u w=1u
SYMBOL nmos4 208 288 R270
SYMATTR InstName M2
SYMATTR Value2 l=45nm w=1u
SYMBOL cap 480 240 R0
SYMATTR InstName C1
SYMATTR Value 0.8pF
SYMBOL nmos4 752 144 R0
SYMATTR InstName M3
SYMATTR Value2 l=45nm w=80u
SYMBOL nmos4 752 320 R0
SYMATTR InstName M4
SYMATTR Value2 l=0.25u w=1.5u
TEXT 296 -160 Left 2 !.include ptm32nm.lib
TEXT 336 64 Left 2 ;1u/0.5u
TEXT 168 144 Left 2 ;1u/45nm
TEXT 840 136 Left 2 ;80u/45nm
TEXT 880 392 Left 2 ;1u/0.25u
TEXT 120 -128 Left 2 ;for 1Mhz sampling and 5%duty cycle clock
TEXT -192 24 Left 2 ;1uA
TEXT -136 472 Left 2 ;0.4v

1st_stage_pos_edge_4bit_pipo.asc, the sub-circuit schematic file:
Version 4
SHEET 1 1096 680
WIRE 96 208 96 64
WIRE 144 208 96 208
WIRE 320 208 320 -48
WIRE 320 208 304 208
WIRE 352 208 352 64
WIRE 368 208 352 208
WIRE 544 208 544 -48
WIRE 544 208 528 208
WIRE 576 208 576 64
WIRE 608 208 576 208
WIRE 784 208 784 -48
WIRE 784 208 768 208
WIRE 832 208 832 64
WIRE 848 208 832 208
WIRE 1024 208 1024 -48
WIRE 1024 208 1008 208
WIRE 64 240 -240 240
WIRE 144 256 80 256
WIRE 368 256 352 256
WIRE 608 256 576 256
WIRE 848 256 816 256
WIRE 64 336 64 240
WIRE 80 336 80 256
WIRE 80 336 64 336
WIRE 352 336 352 256
WIRE 352 336 80 336
WIRE 576 336 576 256
WIRE 576 336 352 336
WIRE 816 336 816 256
WIRE 816 336 576 336
WIRE 224 368 224 304
WIRE 448 368 448 304
WIRE 448 368 224 368
WIRE 576 368 448 368
WIRE 688 368 688 304
WIRE 688 368 576 368
WIRE 928 368 928 304
WIRE 928 368 688 368
WIRE 576 432 576 368
FLAG 96 64 d0
IOPIN 96 64 In
FLAG 352 64 d1
IOPIN 352 64 In
FLAG 576 64 d2
IOPIN 576 64 In
FLAG 832 64 d3
IOPIN 832 64 In
FLAG 320 -48 q0
IOPIN 320 -48 Out
FLAG 544 -48 q1
IOPIN 544 -48 Out
FLAG 784 -48 q2
IOPIN 784 -48 Out
FLAG 1024 -48 q3
IOPIN 1024 -48 Out
FLAG -240 240 clk
IOPIN -240 240 In
FLAG 576 432 clr
IOPIN 576 432 In
SYMBOL Digital\\dflop 224 160 R0
SYMATTR InstName A1
SYMBOL Digital\\dflop 448 160 R0
SYMATTR InstName A2
SYMBOL Digital\\dflop 688 160 R0
SYMATTR InstName A3
SYMBOL Digital\\dflop 928 160 R0
SYMATTR InstName A4
TEXT -392 408 Left 2 ;positive edge triggered FF 1. Good if you have to feed the inverted signal as clk

The netlist it stands for:
* ADC_allblocks_oneClock.asc
XX1 N008 0 N009 N001 N007 transmission_switch_100ns_5ns_5ps_8fmf_symbolckt
V1 N009 0 SINE(0.5v 0.5v 200k 0 0 90) AC 0.5v
vdd1 N001 0 1.2v
I1 N001 N012 1µA
V2 N002 0 0.6v
V§clk_counter1 N004 0 PULSE(0 1 0 5ps 5ps 0.5us 1us)
XX2 N006 N008 0 N001 d0 d1 d2 d3 mod16upcounter_ckt
XX3 0 N002 N010 N011 v_sample v_ramp N001 v_out_comp cp_cn_selective_comp_new_ckt
I2 N001 N010 10µA
I3 N011 0 5µA
A1 0 v_out_comp 0 N005 0 N006 0 0 OR
A2 0 0 N004 N004 0 N005 0 0 OR
XX4 0 N003 N007 N001 v_sample cd_buffer_const_pot
V3 N003 0 0.1v
XX5 N008 0 N012 N002 N001 v_ramp ramp_ckt_32nm_cd_buffer_ckt
XX6 v_out_comp NC_01 d0 d1 d2 d3 q0 q1 q2 q3 1st_stage_pos_edge_4bit_pipo
A3 d3 d2 d1 d0 0 N008 0 0 OR

* block symbol definitions
.subckt transmission_switch_100ns_5ns_5ps_8fmf_symbolckt clk GND v_sig vcc v_out
M1 vcc clk N001 vcc PMOS l=45nm w=30u
M2 N001 clk GND GND NMOS l=45nm w=15u
M3 v_out N001 v_sig vcc PMOS l=45nm w=0.5u
M4 v_sig clk v_out GND NMOS l=45nm w=0.25u
C1 v_out GND 8fmF
.include ptm32nm.lib
* 0.25u/45nm
* 0.25u/0.18u
* 0.5u/0.18u
* 0.5u/45nm
;include "C:\Users\Chiradip Biswas\AppData\Local\LTspice\projects\p045\p045_cmos_models_tt.inc"
.ends transmission_switch_100ns_5ns_5ps_8fmf_symbolckt

.subckt mod16upcounter_ckt clk clr gnd vcc q0 q1 q2 q3
A1 N002 0 N005 0 clr N002 q0 0 DFLOP
A2 N003 0 N002 0 clr N003 q1 0 DFLOP
A3 N001 0 N003 0 clr N001 q2 0 DFLOP
A4 N004 0 N001 0 clr N004 q3 0 DFLOP
XX1 gnd clk vcc N005 fast_inverterckt
* rest are -ve edge triggered
* mod16 up counter
.ends mod16upcounter_ckt

.subckt fast_inverterckt GND signal vcc v_out
M1 v_out signal GND GND NMOS l=45nm w=1u
M2 vcc signal v_out vcc PMOS l=45nm w=1.8u
* 1.8u/45nm
* 1u/45nm
.include ptm32nm.lib
.ends fast_inverterckt

.subckt cp_cn_selective_comp_new_ckt gnd half_vdd i_ref_nmos_total I_ref_pmos_neg v_in v_ref vdd v_out_net
XX1 cn_out cp_out gnd select_inverter vdd v_out_net analog_2_to_1mux
XX2 gnd I_ref_pmos_neg v_in v_ref vdd cp_out static_comparator_pmosbased_ckt
XX3 gnd N001 vdd select_inverter fast_inverterckt
XX4 gnd i_ref_nmos_total v_in v_ref vdd cn_out static_comparator_nmos_based_ckt
XX5 gnd i_ref_nmos_total v_in half_vdd vdd N001 static_comparator_nmos_based_ckt
* Cp
* selective comp
* analog 2x1 mux
* Cn
* fast inverter
* 10uA
* -5uA
.ends cp_cn_selective_comp_new_ckt

.subckt analog_2_to_1mux c_n c_p GND select vcc v_out
M1 c_p N001 v_out GND NMOS l=45nm w=0.25u
M2 c_n select v_out GND NMOS l=45nm w=0.25u
M3 v_out select c_p vcc PMOS l=45nm w=0.5u
M4 v_out N001 c_n vcc PMOS l=45nm w=0.5u
M5 vcc select N001 vcc PMOS l=0.18u w=1.75u
M6 N001 select GND GND NMOS l=0.18u w=0.25u
.include ptm32nm.lib
* 0.5u/45nm
* 0.5u/45nm
* 0.25u/45nm
* 0.25u/45nm
* 1.75u/0.18u
* 0.25u/0.18u
;include "C:\Users\Chiradip Biswas\AppData\Local\LTspice\projects\p045\p045_cmos_models_tt.inc"
.ends analog_2_to_1mux

.subckt static_comparator_pmosbased_ckt gnd I_ref_neg v_in v_ref vdd v_out
M1 vdd I_ref_neg N001 vdd PMOS l=1u w=100u
M2 N001 v_in N002 vdd PMOS l=1u w=25u
M3 N001 v_ref v_out_1 vdd PMOS l=1u w=25u
M4 v_out_1 N002 gnd gnd NMOS l=1u w=25u
M5 N002 N002 gnd gnd NMOS l=1u w=25u
M6 vdd I_ref_neg I_ref_neg vdd PMOS l=1u w=100u
M7 v_out v_out_1 gnd gnd NMOS l=0.5u w=25u
M8 vdd I_ref_neg v_out vdd PMOS l=0.5u w=50u
.include "C:\Users\Chiradip Biswas\AppData\Local\LTspice\projects\p045\p045_cmos_models_tt.inc"
* To find the gain always use frequency response the voltage sweep is not trustable to give accurate result
* 25u/1u
* 100u/1u
* 100u/1u
* 25u/1u
* 50u/0.5u
* 25u/0.5u
* v+ required for v- 0.1v : 99.472237mV
* -5uA
.ends static_comparator_pmosbased_ckt

.subckt static_comparator_nmos_based_ckt gnd I_ref v_in v_ref vdd v_out
M1 N002 I_ref gnd gnd NMOS l=1u w=100u
M2 N001 v_in N002 gnd NMOS l=0.5u w=20u
M3 v_out_1 v_ref N002 gnd NMOS l=0.5u w=20u
M4 vdd N001 N001 vdd PMOS l=0.25u w=20u
M5 vdd N001 v_out_1 vdd PMOS l=0.25u w=20u
M6 I_ref I_ref gnd gnd NMOS l=1u w=100u
M7 vdd v_out_1 v_out vdd PMOS l=0.5u w=10u
M8 v_out I_ref gnd gnd NMOS l=0.5u w=50u
.include "C:\Users\Chiradip Biswas\AppData\Local\LTspice\projects\p045\p045_cmos_models_tt.inc"
* 100u/1u
* 20u/0.25u
* 20u/0.5u
* 100u/1u
* 10u/0.5u
* 50u/1u
* To find the gain always use frequency response the voltage sweep is not trustable to give accurate result
.ends static_comparator_nmos_based_ckt

.subckt cd_buffer_const_pot gnd v_bias v_in vdd v_out
M1 vdd v_in v_out gnd NMOS l=32nm w=80u
M2 v_out v_bias gnd gnd NMOS l=0.25u w=15u
* 80u/32nm
* 15u/0.25u
.include ptm32nm.lib
* 0.1v
.ends cd_buffer_const_pot

.subckt ramp_ckt_32nm_cd_buffer_ckt clk GND I_ref v_bias vcc v_out
M1 I_ref clk N001 vcc PMOS l=0.5u w=1u
M2 GND clk N001 GND NMOS l=45nm w=1u
C1 N001 GND 0.8pF
M3 vcc N001 v_out GND NMOS l=45nm w=80u
M4 v_out v_bias GND GND NMOS l=0.25u w=1.5u
.include ptm32nm.lib
* 1u/0.5u
* 1u/45nm
* 80u/45nm
* 1u/0.25u
* for 1Mhz sampling and 5%duty cycle clock
* 1uA
* 0.4v
.ends ramp_ckt_32nm_cd_buffer_ckt

.subckt 1st_stage_pos_edge_4bit_pipo clk clr d0 d1 d2 d3 q0 q1 q2 q3
A1 d0 0 clk 0 clr 0 q0 0 DFLOP
A2 d1 0 clk 0 clr 0 q1 0 DFLOP
A3 d2 0 clk 0 clr 0 q2 0 DFLOP
A4 d3 0 clk 0 clr 0 q3 0 DFLOP
* positive edge triggered FF 1. Good if you have to feed the inverted signal as clk
.ends 1st_stage_pos_edge_4bit_pipo

.model NMOS NMOS
.model PMOS PMOS
.lib standard.mos
.tran 18us
* transmission switch
* voltage ramping ckt
* selective comparator
* when reference is lower, o/p=high
* PIPO register negative edge triggered
* mod16 asynchronous counter
* reset the counter at high phase of the  sampling clock
* may need some buffer (delay)
* an unity gain buffer needed
* v_ref=ramp
* the components other than amplifier are based on 32nm model mostly. Comparator Cp,Cn,selecting comp made with 45nm
* cd buffer
.backanno
.end